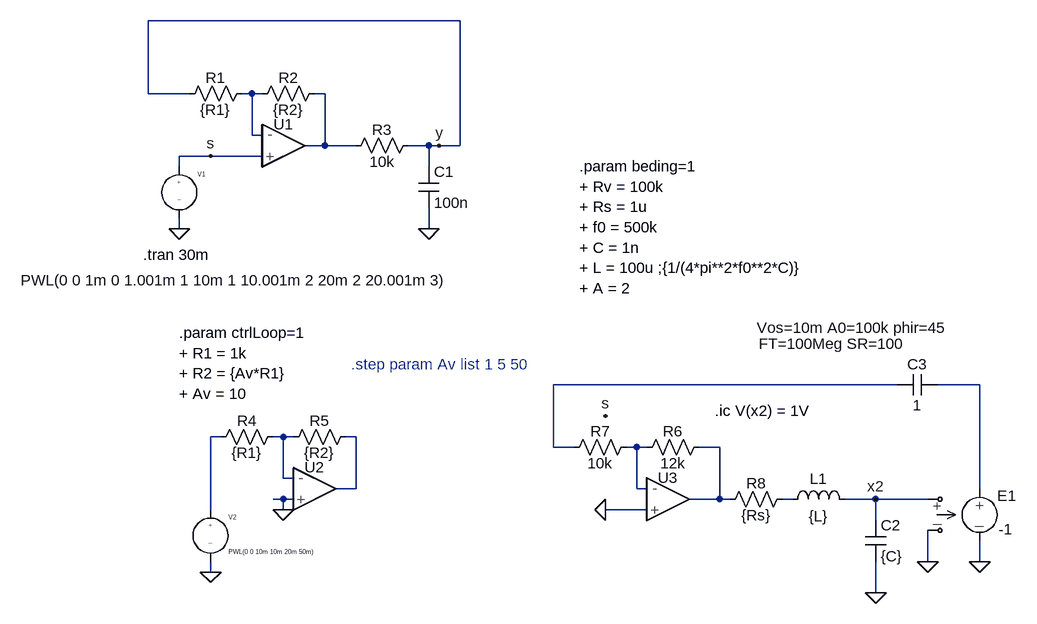
[diagram p0: schematic schleifenverstärkung.asc]
schleifenverstärkung.asc, the LTspice schematic file:
Version 4
SHEET 1 1892 916
WIRE 400 -32 -80 -32
WIRE -80 80 -80 -32
WIRE -16 80 -80 80
WIRE 80 80 64 80
WIRE 96 80 80 80
WIRE 192 80 176 80
WIRE 80 144 80 80
WIRE 96 144 80 144
WIRE 192 160 192 80
WIRE 192 160 160 160
WIRE 240 160 192 160
WIRE 352 160 320 160
WIRE 368 160 352 160
WIRE 400 160 400 -32
WIRE 400 160 368 160
WIRE 16 176 -32 176
WIRE 96 176 16 176
WIRE -32 192 -32 176
WIRE 352 192 352 160
WIRE -32 288 -32 272
WIRE 352 288 352 256
WIRE 1072 528 544 528
WIRE 1200 528 1136 528
WIRE 32 608 16 608
WIRE 128 608 112 608
WIRE 144 608 128 608
WIRE 240 608 224 608
WIRE 544 624 544 528
WIRE 576 624 544 624
WIRE 672 624 656 624
WIRE 688 624 672 624
WIRE 800 624 768 624
WIRE 128 672 128 608
WIRE 144 672 128 672
WIRE 240 688 240 608
WIRE 240 688 208 688
WIRE 672 688 672 624
WIRE 688 688 672 688
WIRE 1200 688 1200 528
WIRE 128 704 112 704
WIRE 144 704 128 704
WIRE 800 704 800 624
WIRE 800 704 752 704
WIRE 816 704 800 704
WIRE 912 704 896 704
WIRE 1040 704 992 704
WIRE 1120 704 1040 704
WIRE 16 720 16 608
WIRE 128 720 128 704
WIRE 688 720 624 720
WIRE 1040 736 1040 704
WIRE 1120 800 1120 752
WIRE 1200 800 1200 768
WIRE 16 816 16 800
WIRE 1040 848 1040 800
FLAG -32 288 0
FLAG 352 288 0
FLAG 368 160 y
FLAG 16 176 s
FLAG 16 816 0
FLAG 128 720 0
FLAG 624 576 s
FLAG 1040 848 0
FLAG 1040 704 x2
FLAG 624 720 0
FLAG 1200 800 0
FLAG 1120 800 0
SYMBOL EIT_Semiconductors\\op_3 128 160 R0
WINDOW 123 -17 69 Invisible 2
WINDOW 3 -16 43 Invisible 2
SYMATTR InstName U1
SYMBOL res -32 96 R270
WINDOW 0 25 56 VTop 2
WINDOW 3 7 56 VBottom 2
SYMATTR InstName R1
SYMATTR Value {R1}
SYMBOL res 80 96 R270
WINDOW 0 25 56 VTop 2
WINDOW 3 7 56 VBottom 2
SYMATTR InstName R2
SYMATTR Value {R2}
SYMBOL MDB_sym\\source-V -32 176 R0
WINDOW 3 -244 191 Left 2
WINDOW 123 0 0 Left 2
WINDOW 39 0 0 Left 2
SYMATTR Value PWL(0 0 1m 0 1.001m 1 10m 1 10.001m 2 20m 2 20.001m 3)
SYMATTR InstName V1
SYMBOL res 224 176 R270
WINDOW 0 25 56 VTop 2
WINDOW 3 7 56 VBottom 2
SYMATTR InstName R3
SYMATTR Value 10k
SYMBOL cap 336 192 R0
SYMATTR InstName C1
SYMATTR Value 100n
SYMBOL EIT_Semiconductors\\op_3 176 688 R0
WINDOW 123 -17 69 Invisible 2
WINDOW 3 -16 43 Invisible 2
SYMATTR InstName U2
SYMBOL res 16 624 R270
WINDOW 0 25 56 VTop 2
WINDOW 3 7 56 VBottom 2
SYMATTR InstName R4
SYMATTR Value {R1}
SYMBOL res 128 624 R270
WINDOW 0 25 56 VTop 2
WINDOW 3 7 56 VBottom 2
SYMATTR InstName R5
SYMATTR Value {R2}
SYMBOL MDB_sym\\source-V 16 704 R0
WINDOW 123 0 0 Left 2
WINDOW 39 0 0 Left 2
SYMATTR InstName V2
SYMATTR Value PWL(0 0 10m 10m 20m 50m)
SYMBOL EIT_Semiconductors\\op_3 720 704 R0
WINDOW 123 140 -239 Left 2
WINDOW 3 -16 43 Invisible 2
WINDOW 39 137 -264 Left 2
SYMATTR Value2 FT=100Meg SR=100
SYMATTR InstName U3
SYMATTR SpiceLine Vos=10m A0=100k phir=45
SYMBOL res 672 640 R270
WINDOW 0 25 56 VTop 2
WINDOW 3 7 56 VBottom 2
SYMATTR InstName R6
SYMATTR Value 12k
SYMBOL res 560 640 R270
WINDOW 0 25 56 VTop 2
WINDOW 3 7 56 VBottom 2
SYMATTR InstName R7
SYMATTR Value 10k
SYMBOL res 800 720 R270
WINDOW 0 25 56 VTop 2
WINDOW 3 7 56 VBottom 2
SYMATTR InstName R8
SYMATTR Value {Rs}
SYMBOL cap 1024 736 R0
SYMATTR InstName C2
SYMATTR Value {C}
SYMBOL ind 896 720 R270
WINDOW 0 32 56 VTop 2
WINDOW 3 5 56 VBottom 2
SYMATTR InstName L1
SYMATTR Value {L}
SYMBOL crtl-V-V 1200 672 R0
SYMATTR InstName E1
SYMATTR Value -1
SYMBOL cap 1136 512 R90
WINDOW 0 0 32 VBottom 2
WINDOW 3 32 32 VTop 2
SYMATTR InstName C3
SYMATTR Value 1
TEXT -88 328 Left 2 !.tran 30m
TEXT -32 448 Left 2 !.param ctrlLoop=1\n+ R1 = 1k\n+ R2 = {Av*R1}\n+ Av = 10
TEXT 232 496 Left 2 ;.step param Av list 1 5 50
TEXT 584 192 Left 2 !.param beding=1\n+ Rv = 100k\n+ Rs = 1u\n+ f0 = 500k\n+ C = 1n\n+ L = 100u ;{1/(4*pi**2*f0**2*C)}\n+ A = 2
TEXT 792 568 Left 2 !.ic V(x2) = 1V

The netlist it stands for:
* schleifenverstärkung.asc
XU1 s N001 N002 opamp_param_3 Vp=10 Vm=-10 Ilim=20m FT=10Meg SR=10 Vos=0 A0=100k phir=45 en=0 enk=0 in=0 ink=0 Rin=500Meg  ; pins In+ In- OUT
R1 y N001 {R1}
R2 N001 N002 {R2}
V1 s 0 PWL(0 0 1m 0 1.001m 1 10m 1 10.001m 2 20m 2 20.001m 3)
R3 N002 y 10k
C1 y 0 100n
XU2 0 N006 N007 opamp_param_3 Vp=10 Vm=-10 Ilim=20m FT=10Meg SR=10 Vos=0 A0=100k phir=45 en=0 enk=0 in=0 ink=0 Rin=500Meg  ; pins In+ In- OUT
R4 N005 N006 {R1}
R5 N006 N007 {R2}
V2 N005 0 PWL(0 0 10m 10m 20m 50m)
XU3 0 N008 N009 opamp_param_3 Vp=10 Vm=-10 Ilim=20m FT=100Meg SR=100 Vos=10m A0=100k phir=45 en=0 enk=0 in=0 ink=0 Rin=500Meg  ; pins In+ In- OUT
R6 N008 N009 12k
R7 N003 N008 10k
R8 N009 N010 {Rs}
C2 x2 0 {C}
L1 N010 x2 {L}
E1 N004 0 x2 0 -1
C3 N004 N003 1
.tran 30m
.param ctrlLoop=1
+ R1 = 1k
+ R2 = {Av*R1}
+ Av = 10
* .step param Av list 1 5 50
.param beding=1
+ Rv = 100k
+ Rs = 1u
+ f0 = 500k
+ C = 1n
+ L = 100u ;{1/(4*pi**2*f0**2*C)}
+ A = 2
.ic V(x2) = 1V
.lib EIT_sub\opamp_parametrierbar.sub
.backanno
.end